# Altium schematic sheet Shining Pig.SchDoc (part 1 of 3)
size 292 x 228 mm
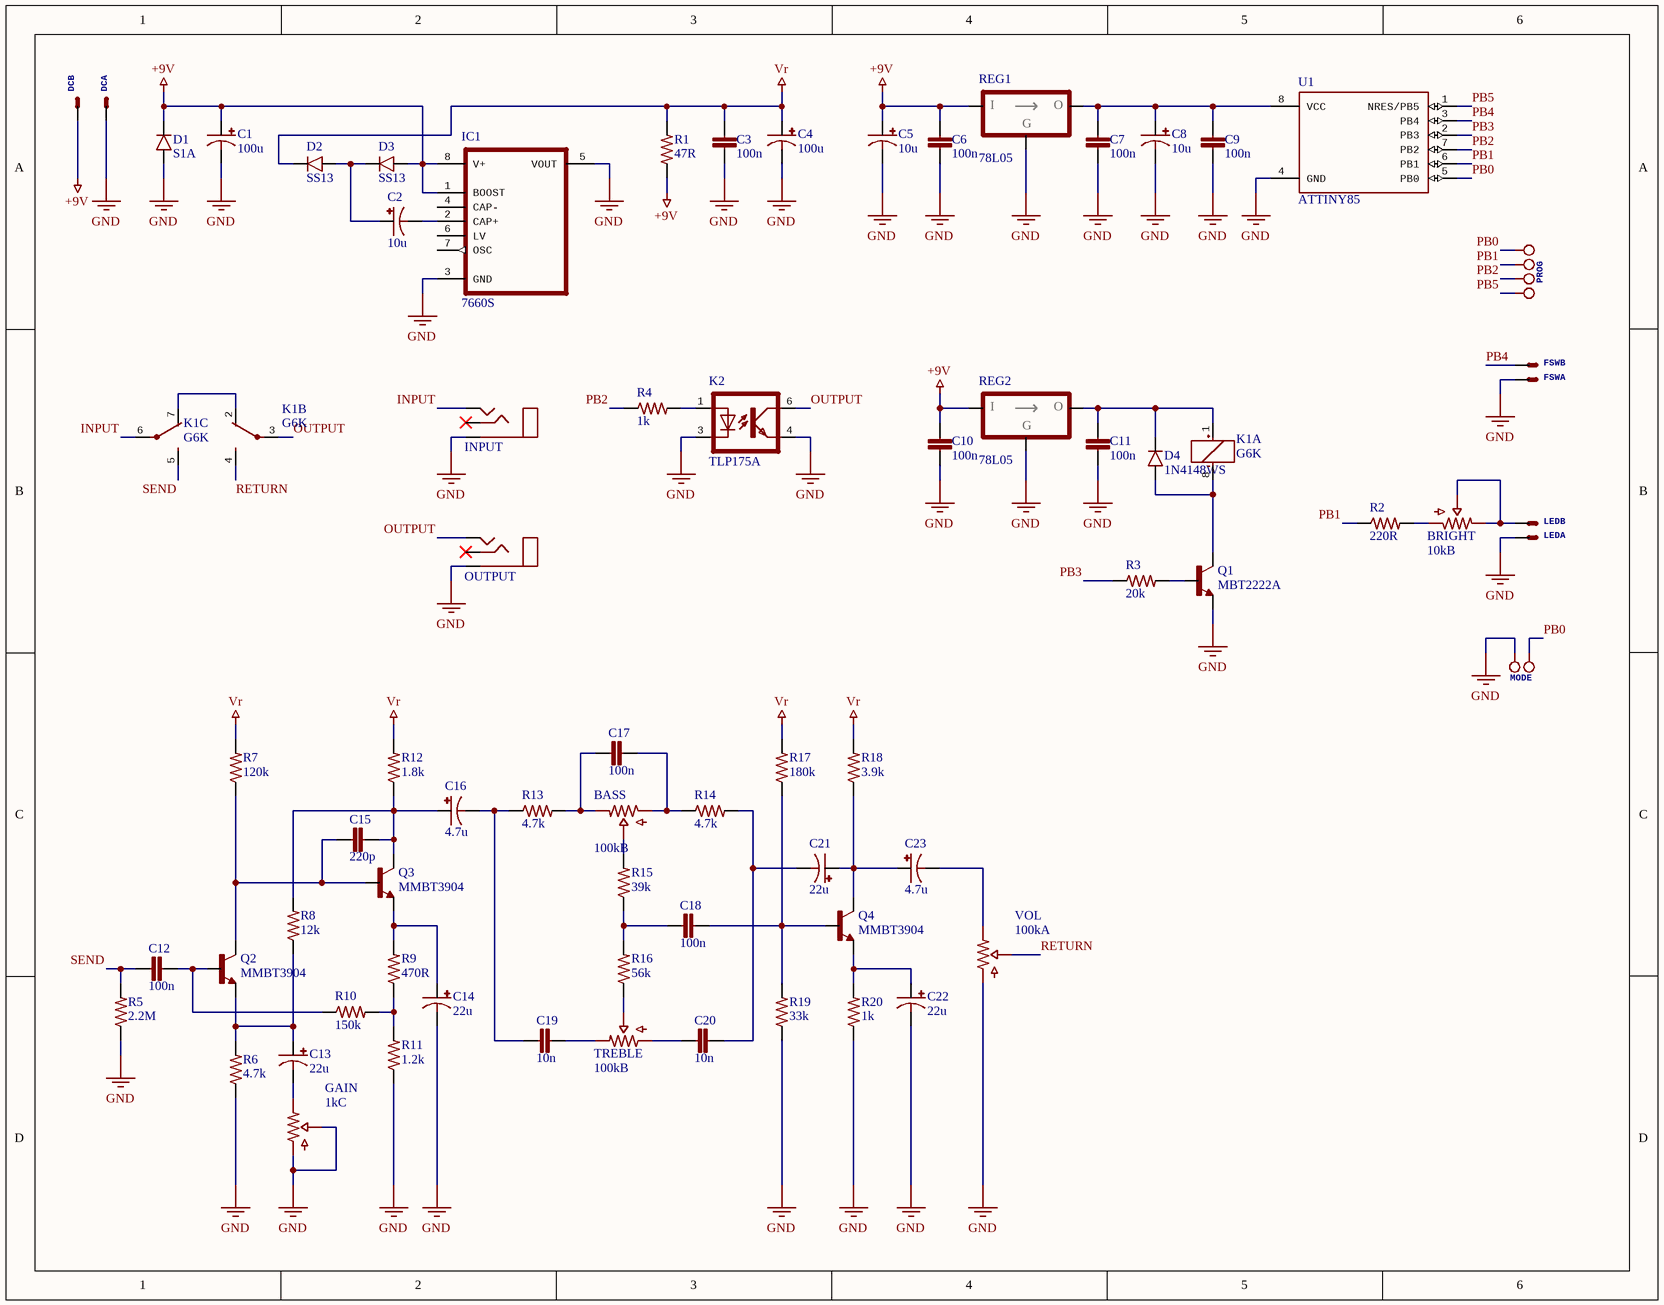
[diagram p0: Shining Pig.SchDoc]

## Parts
BASS  100kB  [ALPHA_16mm_BOTTOM]
BRIGHT  10kB  [BOURNS_3362P]
C1  100u  [CAPAE_D]
C2  10u  [CAPAE_B]
C3  100n  [CHIP_0603]
C4  100u  [CAPAE_D]
C5  10u  [CAPAE_B]
C6  100n  [CHIP_0603]
C7  100n  [CHIP_0603]
C8  10u  [CAPAE_B]
C9  100n  [CHIP_0603]
C10  100n  [CHIP_0603]
C11  100n  [CHIP_0603]
C12  100n  [CHIP_1206]
C13  22u  [CAPAE_D]
C14  22u  [CAPAE_D]
C15  220p  [CHIP_0603]
C16  4.7u  [CAPAE_C]
C17  100n  [CHIP_1206]
C18  100n  [CHIP_1206]
C19  10n  [CHIP_0603]
C20  10n  [CHIP_0603]
C21  22u  [CAPAE_D]
C22  22u  [CAPAE_D]
C23  4.7u  [CAPAE_C]
D1  S1A  [DO214]
D2  SS13  [SOD123F]
D3  SS13  [SOD123F]
D4  1N4148WS  [SOD323]
DC  J_JST-XH-02  [JST-XH-02]  (value not drawn)  (parts A,B of 2)
FSW  J_JST-XH-02  [JST-XH-02]  (value not drawn)  (parts A,B of 2)
GAIN  1kC  [ALPHA_16mm_BOTTOM]
IC1  7660S  [SO8]
INPUT  J_STEREO  [STEREO]  (value not drawn)
K1  G6K  [G6K]  (parts A,B,C of 3)
K2  TLP175A  [TLP175A]
LED  J_JST-XH-02  [JST-XH-02]  (value not drawn)  (parts A,B of 2)
MODE  J_HEADER_2PINS  [HEADER_2PINS]  (value not drawn)
OUTPUT  J_STEREO  [STEREO]  (value not drawn)
PROG  J_HEADER_4PINS_FEM  [HEADER_4Pins_FEM]  (value not drawn)
Q1  MBT2222A  [SOT323]
Q2  MMBT3904  [SOT23]
Q3  MMBT3904  [SOT23]
Q4  MMBT3904  [SOT23]
R1  47R  [CHIP_R_1206]
R2  220R  [CHIP_R_1206]
R3  20k  [CHIP_R_0603]
R4  1k  [CHIP_R_0603]
R5  2.2M  [CHIP_R_0603]
R6  4.7k  [CHIP_R_0603]
R7  120k  [CHIP_R_1206]
R8  12k  [CHIP_R_0603]
R9  470R  [CHIP_R_0603]
R10  150k  [CHIP_R_0603]
R11  1.2k  [CHIP_R_0603]
R12  1.8k  [CHIP_R_1206]
R13  4.7k  [CHIP_R_0603]
R14  4.7k  [CHIP_R_0603]
R15  39k  [CHIP_R_0603]
R16  56k  [CHIP_R_0603]
R17  180k  [CHIP_R_1206]
R18  3.9k  [CHIP_R_1206]
R19  33k  [CHIP_R_0603]
R20  1k  [CHIP_R_0603]
REG1  78L05  [SOT23-3]
REG2  78L05  [SOT23-3]
TREBLE  100kB  [ALPHA_16mm_BOTTOM]
U1  ATTINY85  [SOP8]
VOL  100kA  [ALPHA_16mm_BOTTOM]

## Nets
+9V: C1.+ C5.+ C6.1 C10.1 D1.1 D3.2 DC.1(S) IC1.1(BOOST) IC1.8(V+) R1.1 REG1.2(INPUT) REG2.2(INPUT)
GND: C1.- C3.2 C4.- C5.- C6.2 C7.2 C8.- C9.2 C10.2 C11.2 C14.- C22.- D1.2 DC.2(S) FSW.2(S) GAIN.1 GAIN.2 IC1.3(GND) IC1.5(VOUT) INPUT.S K2.3(C) K2.4(EMIT) LED.2(S) MODE.1 OUTPUT.S Q1.2(E) R5.1 R6.1 R11.1 R19.1 R20.1 REG1.3(COMMON) REG2.3(COMMON) U1.4(GND) VOL.1
Vr: C3.1 C4.+ D2.1 R1.2 R7.2 R12.2 R17.2 R18.2
INPUT: INPUT.T K1.6(P)
OUTPUT: K1.3(P) K2.6(COL) OUTPUT.T
PB0: MODE.2 PROG.4 U1.5(PB0)
PB1: PROG.3 R2.1 U1.6(PB1)
PB2: PROG.2 R4.1 U1.7(PB2)
PB3: R3.1 U1.2(PB3)
PB4: FSW.1(S) U1.3(PB4)
PB5: PROG.1 U1.1(NRES/PB5)
RETURN: K1.4(S) VOL.2
SEND: C12.2 K1.5(S) R5.2
NetBASS_1: BASS.1 C17.1 R14.1
NetBASS_2: BASS.2 R15.2
NetBASS_3: BASS.3 C17.2 R13.2
NetBRIGHT_1: BRIGHT.1 R2.2
NetBRIGHT_2: BRIGHT.2 BRIGHT.3 LED.1(S)
NetC2_+: C2.+ D2.2 D3.1
NetC2_-: C2.- IC1.2(CAP+)
NetC7_1: C7.1 C8.+ C9.1 REG1.1(OUTPUT) U1.8(VCC)
NetC11_1: C11.1 D4.1 K1.1(+) REG2.1(OUTPUT)
NetC12_1: C12.1 Q2.1(B) R10.1
NetC13_+: C13.+ Q2.2(E) R6.2 R8.1
NetC13_-: C13.- GAIN.3
NetC14_+: C14.+ Q3.2(E) R9.2
NetC15_1: C15.1 C16.+ Q3.3(C) R8.2 R12.1
NetC15_2: C15.2 Q2.3(C) Q3.1(B) R7.1
NetC16_-: C16.- C19.2 R13.1
NetC18_1: C18.1 Q4.1(B) R17.1 R19.2
NetC18_2: C18.2 R15.1 R16.2
NetC19_1: C19.1 TREBLE.3
NetC20_1: C20.1 C21.- R14.2
NetC20_2: C20.2 TREBLE.1
NetC21_+: C21.+ C23.+ Q4.3(C) R18.1
NetC22_+: C22.+ Q4.2(E) R20.2
NetC23_-: C23.- VOL.3
NetD4_2: D4.2 K1.8(-) Q1.3(C)
NetK1_2: K1.2(O) K1.7(O)
NetK2_1: K2.1(A) R4.2
NetQ1_1: Q1.1(B) R3.2
NetR9_1: R9.1 R10.2 R11.2
NetR16_1: R16.1 TREBLE.2

Not connected (* = marked no-connect by the designer): IC1 4(CAP-) 6(LV) 7(OSC); INPUT R*; OUTPUT R*